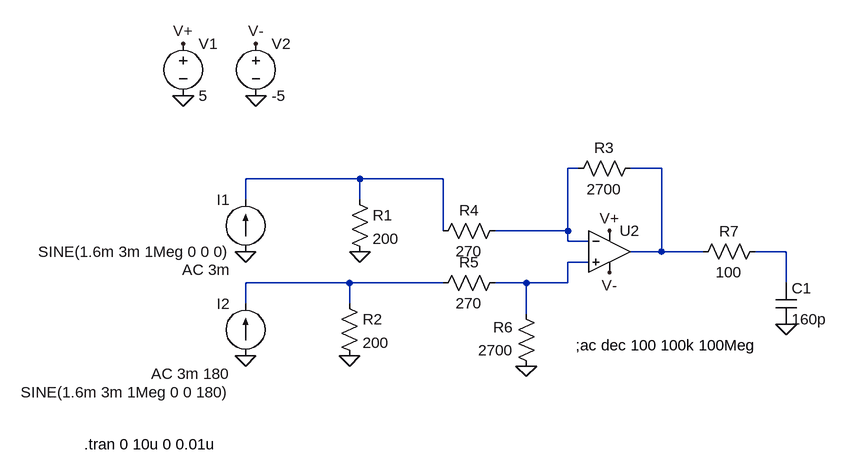
[diagram p0: schematic DDS_out.asc]
DDS_out.asc, the LTspice schematic file:
Version 4
SHEET 1 980 680
WIRE 592 48 576 48
WIRE 720 48 672 48
WIRE 256 64 80 64
WIRE 384 64 256 64
WIRE 80 96 80 64
WIRE 256 96 256 64
WIRE 384 144 384 64
WIRE 576 144 576 48
WIRE 576 144 464 144
WIRE 576 160 576 144
WIRE 608 160 576 160
WIRE 720 176 720 48
WIRE 720 176 672 176
WIRE 784 176 720 176
WIRE 912 176 864 176
WIRE 608 192 576 192
WIRE 240 224 80 224
WIRE 384 224 240 224
WIRE 512 224 464 224
WIRE 576 224 576 192
WIRE 576 224 512 224
WIRE 912 224 912 176
WIRE 80 256 80 224
WIRE 240 256 240 224
WIRE 512 272 512 224
FLAG 512 352 0
FLAG 240 336 0
FLAG 80 336 0
FLAG 80 176 0
FLAG 256 176 0
FLAG -16 -144 V+
FLAG 96 -144 V-
FLAG 96 -64 0
FLAG -16 -64 0
FLAG 640 144 V+
FLAG 640 208 V-
FLAG 912 288 0
SYMBOL current 80 176 R180
WINDOW 0 24 80 Left 2
WINDOW 3 24 0 Left 2
WINDOW 123 24 -28 Left 2
WINDOW 39 0 0 Left 2
SYMATTR InstName I1
SYMATTR Value SINE(1.6m 3m 1Meg 0 0 0)
SYMATTR Value2 AC 3m
SYMBOL current 80 336 R180
WINDOW 0 24 80 Left 2
WINDOW 3 24 -56 Left 2
WINDOW 123 24 -28 Left 2
WINDOW 39 0 0 Left 2
SYMATTR InstName I2
SYMATTR Value SINE(1.6m 3m 1Meg 0 0 180)
SYMATTR Value2 AC 3m 180
SYMBOL res 240 80 R0
SYMATTR InstName R1
SYMATTR Value 200
SYMBOL res 224 240 R0
SYMATTR InstName R2
SYMATTR Value 200
SYMBOL res 576 64 R270
WINDOW 0 32 56 VTop 2
WINDOW 3 0 56 VBottom 2
SYMATTR InstName R3
SYMATTR Value 2700
SYMBOL res 368 160 R270
WINDOW 0 32 56 VTop 2
WINDOW 3 0 56 VBottom 2
SYMATTR InstName R4
SYMATTR Value 270
SYMBOL res 480 208 R90
WINDOW 0 0 56 VBottom 2
WINDOW 3 32 56 VTop 2
SYMATTR InstName R5
SYMATTR Value 270
SYMBOL res 528 368 R180
WINDOW 0 36 76 Left 2
WINDOW 3 36 40 Left 2
SYMATTR InstName R6
SYMATTR Value 2700
SYMBOL Opamps\\UniversalOpamp2 640 176 R0
SYMATTR InstName U2
SYMATTR SpiceModel level.1
SYMATTR Value2 Avol=10Meg GBW=1000Meg Slew=10Meg
SYMBOL voltage -16 -160 R0
WINDOW 123 0 0 Left 2
WINDOW 39 0 0 Left 2
SYMATTR InstName V1
SYMATTR Value 5
SYMBOL voltage 96 -160 R0
WINDOW 123 0 0 Left 2
WINDOW 39 0 0 Left 2
SYMATTR InstName V2
SYMATTR Value -5
SYMBOL res 880 160 R90
WINDOW 0 0 56 VBottom 2
WINDOW 3 32 56 VTop 2
SYMATTR InstName R7
SYMATTR Value 100
SYMBOL cap 896 224 R0
SYMATTR InstName C1
SYMATTR Value 160p
TEXT 588 320 Left 2 !;ac dec 100 100k 100Meg
TEXT -168 472 Left 2 !.tran 0 10u 0 0.01u

The netlist it stands for:
* DDS_out.asc
I1 0 N003 SINE(1.6m 3m 1Meg 0 0 0) AC 3m
I2 0 N006 SINE(1.6m 3m 1Meg 0 0 180) AC 3m 180
R1 N003 0 200
R2 N006 0 200
R3 N001 N002 2700
R4 N003 N001 270
R5 N005 N006 270
R6 0 N005 2700
XU2 N005 N001 V+ V- N002 level.1 Avol=10Meg GBW=1000Meg Slew=10Meg ilimit=25m rail=0 Vos=0 phimargin=45 en=0 enk=0 in=0 ink=0 Rin=500Meg  ; pins IN+ IN- V+ V- OUT
V1 V+ 0 5
V2 V- 0 -5
R7 N004 N002 100
C1 N004 0 160p
;ac dec 100 100k 100Meg
.tran 0 10u 0 0.01u
.lib UniversalOpamps2.sub
.backanno
.end